# EAGLE design SparkFun_ProtoShield_Kit_rev40 (EAGLE 7.7.0)
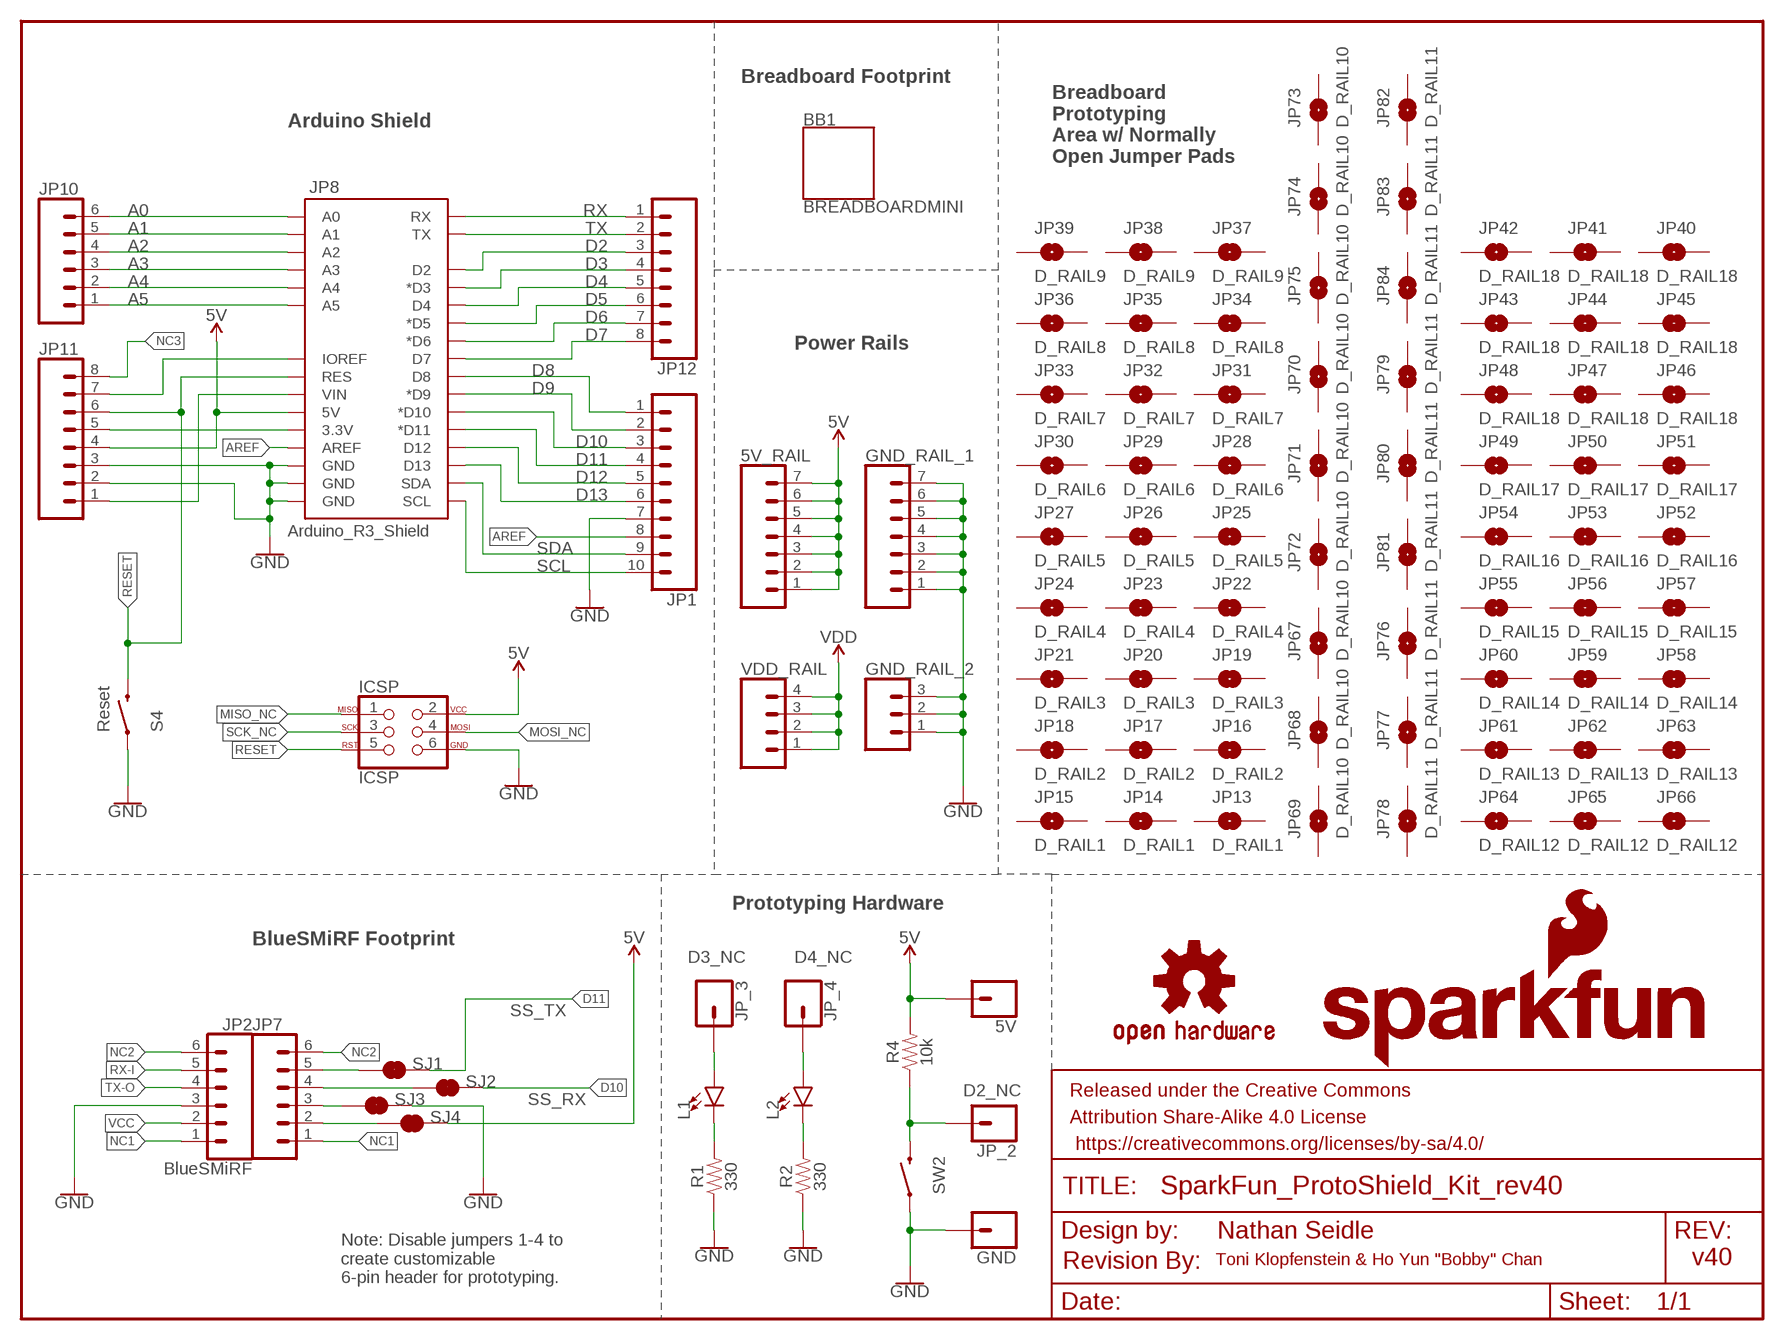
[diagram p0: schematic, sheet 1]

## Parts
5V  CONN_01  [1X01]
5V_RAIL  CONN_07NO_SILK  [1X07_NO_SILK]
BB1  BREADBOARDMINI  [BREADBOARD-MINI]
FRAME1  FRAME-LETTER  [CREATIVE_COMMONS]
GND  CONN_01  [1X01]
GND_RAIL_1  CONN_07NO_SILK  [1X07_NO_SILK]
GND_RAIL_2  CONN_031X03_NO_SILK  [1X03_NO_SILK]
ICSP  ICSP  AVR_SPI_PROG_3X2PTH  [2X3]
JP1  CONN_10"  [1X10]
JP2  BlueSMiRF  CONN_06SILK_FEMALE_PTH  [1X06]
JP7  CONN_06SILK_FEMALE_PTH  [1X06]
JP8  ARDUINO_R3_SHIELDR3_PROTO_SHIELD  [UNO_R3_PROTO_SHIELD]
JP10  CONN_06SILK_FEMALE_PTH  [1X06]
JP11  CONN_08"  [1X08]
JP12  CONN_08"  [1X08]
JP13  D_RAIL1  JUMPER-SMT_2_NO_NO-SILK  [SMT-JUMPER_2_NO_NO-SILK]
JP14  D_RAIL1  JUMPER-SMT_2_NO_NO-SILK  [SMT-JUMPER_2_NO_NO-SILK]
JP15  D_RAIL1  JUMPER-SMT_2_NO_NO-SILK  [SMT-JUMPER_2_NO_NO-SILK]
JP16  D_RAIL2  JUMPER-SMT_2_NO_NO-SILK  [SMT-JUMPER_2_NO_NO-SILK]
JP17  D_RAIL2  JUMPER-SMT_2_NO_NO-SILK  [SMT-JUMPER_2_NO_NO-SILK]
JP18  D_RAIL2  JUMPER-SMT_2_NO_NO-SILK  [SMT-JUMPER_2_NO_NO-SILK]
JP19  D_RAIL3  JUMPER-SMT_2_NO_NO-SILK  [SMT-JUMPER_2_NO_NO-SILK]
JP20  D_RAIL3  JUMPER-SMT_2_NO_NO-SILK  [SMT-JUMPER_2_NO_NO-SILK]
JP21  D_RAIL3  JUMPER-SMT_2_NO_NO-SILK  [SMT-JUMPER_2_NO_NO-SILK]
JP22  D_RAIL4  JUMPER-SMT_2_NO_NO-SILK  [SMT-JUMPER_2_NO_NO-SILK]
JP23  D_RAIL4  JUMPER-SMT_2_NO_NO-SILK  [SMT-JUMPER_2_NO_NO-SILK]
JP24  D_RAIL4  JUMPER-SMT_2_NO_NO-SILK  [SMT-JUMPER_2_NO_NO-SILK]
JP25  D_RAIL5  JUMPER-SMT_2_NO_NO-SILK  [SMT-JUMPER_2_NO_NO-SILK]
JP26  D_RAIL5  JUMPER-SMT_2_NO_NO-SILK  [SMT-JUMPER_2_NO_NO-SILK]
JP27  D_RAIL5  JUMPER-SMT_2_NO_NO-SILK  [SMT-JUMPER_2_NO_NO-SILK]
JP28  D_RAIL6  JUMPER-SMT_2_NO_NO-SILK  [SMT-JUMPER_2_NO_NO-SILK]
JP29  D_RAIL6  JUMPER-SMT_2_NO_NO-SILK  [SMT-JUMPER_2_NO_NO-SILK]
JP30  D_RAIL6  JUMPER-SMT_2_NO_NO-SILK  [SMT-JUMPER_2_NO_NO-SILK]
JP31  D_RAIL7  JUMPER-SMT_2_NO_NO-SILK  [SMT-JUMPER_2_NO_NO-SILK]
JP32  D_RAIL7  JUMPER-SMT_2_NO_NO-SILK  [SMT-JUMPER_2_NO_NO-SILK]
JP33  D_RAIL7  JUMPER-SMT_2_NO_NO-SILK  [SMT-JUMPER_2_NO_NO-SILK]
JP34  D_RAIL8  JUMPER-SMT_2_NO_NO-SILK  [SMT-JUMPER_2_NO_NO-SILK]
JP35  D_RAIL8  JUMPER-SMT_2_NO_NO-SILK  [SMT-JUMPER_2_NO_NO-SILK]
JP36  D_RAIL8  JUMPER-SMT_2_NO_NO-SILK  [SMT-JUMPER_2_NO_NO-SILK]
JP37  D_RAIL9  JUMPER-SMT_2_NO_NO-SILK  [SMT-JUMPER_2_NO_NO-SILK]
JP38  D_RAIL9  JUMPER-SMT_2_NO_NO-SILK  [SMT-JUMPER_2_NO_NO-SILK]
JP39  D_RAIL9  JUMPER-SMT_2_NO_NO-SILK  [SMT-JUMPER_2_NO_NO-SILK]
JP40  D_RAIL18  JUMPER-SMT_2_NO_NO-SILK  [SMT-JUMPER_2_NO_NO-SILK]
JP41  D_RAIL18  JUMPER-SMT_2_NO_NO-SILK  [SMT-JUMPER_2_NO_NO-SILK]
JP42  D_RAIL18  JUMPER-SMT_2_NO_NO-SILK  [SMT-JUMPER_2_NO_NO-SILK]
JP43  D_RAIL18  JUMPER-SMT_2_NO_NO-SILK  [SMT-JUMPER_2_NO_NO-SILK]
JP44  D_RAIL18  JUMPER-SMT_2_NO_NO-SILK  [SMT-JUMPER_2_NO_NO-SILK]
JP45  D_RAIL18  JUMPER-SMT_2_NO_NO-SILK  [SMT-JUMPER_2_NO_NO-SILK]
JP46  D_RAIL18  JUMPER-SMT_2_NO_NO-SILK  [SMT-JUMPER_2_NO_NO-SILK]
JP47  D_RAIL18  JUMPER-SMT_2_NO_NO-SILK  [SMT-JUMPER_2_NO_NO-SILK]
JP48  D_RAIL18  JUMPER-SMT_2_NO_NO-SILK  [SMT-JUMPER_2_NO_NO-SILK]
JP49  D_RAIL17  JUMPER-SMT_2_NO_NO-SILK  [SMT-JUMPER_2_NO_NO-SILK]
JP50  D_RAIL17  JUMPER-SMT_2_NO_NO-SILK  [SMT-JUMPER_2_NO_NO-SILK]
JP51  D_RAIL17  JUMPER-SMT_2_NO_NO-SILK  [SMT-JUMPER_2_NO_NO-SILK]
JP52  D_RAIL16  JUMPER-SMT_2_NO_NO-SILK  [SMT-JUMPER_2_NO_NO-SILK]
JP53  D_RAIL16  JUMPER-SMT_2_NO_NO-SILK  [SMT-JUMPER_2_NO_NO-SILK]
JP54  D_RAIL16  JUMPER-SMT_2_NO_NO-SILK  [SMT-JUMPER_2_NO_NO-SILK]
JP55  D_RAIL15  JUMPER-SMT_2_NO_NO-SILK  [SMT-JUMPER_2_NO_NO-SILK]
JP56  D_RAIL15  JUMPER-SMT_2_NO_NO-SILK  [SMT-JUMPER_2_NO_NO-SILK]
JP57  D_RAIL15  JUMPER-SMT_2_NO_NO-SILK  [SMT-JUMPER_2_NO_NO-SILK]
JP58  D_RAIL14  JUMPER-SMT_2_NO_NO-SILK  [SMT-JUMPER_2_NO_NO-SILK]
JP59  D_RAIL14  JUMPER-SMT_2_NO_NO-SILK  [SMT-JUMPER_2_NO_NO-SILK]
JP60  D_RAIL14  JUMPER-SMT_2_NO_NO-SILK  [SMT-JUMPER_2_NO_NO-SILK]
JP61  D_RAIL13  JUMPER-SMT_2_NO_NO-SILK  [SMT-JUMPER_2_NO_NO-SILK]
JP62  D_RAIL13  JUMPER-SMT_2_NO_NO-SILK  [SMT-JUMPER_2_NO_NO-SILK]
JP63  D_RAIL13  JUMPER-SMT_2_NO_NO-SILK  [SMT-JUMPER_2_NO_NO-SILK]
JP64  D_RAIL12  JUMPER-SMT_2_NO_NO-SILK  [SMT-JUMPER_2_NO_NO-SILK]
JP65  D_RAIL12  JUMPER-SMT_2_NO_NO-SILK  [SMT-JUMPER_2_NO_NO-SILK]
JP66  D_RAIL12  JUMPER-SMT_2_NO_NO-SILK  [SMT-JUMPER_2_NO_NO-SILK]
JP67  D_RAIL10  JUMPER-SMT_2_NO_NO-SILK  [SMT-JUMPER_2_NO_NO-SILK]
JP68  D_RAIL10  JUMPER-SMT_2_NO_NO-SILK  [SMT-JUMPER_2_NO_NO-SILK]
JP69  D_RAIL10  JUMPER-SMT_2_NO_NO-SILK  [SMT-JUMPER_2_NO_NO-SILK]
JP70  D_RAIL10  JUMPER-SMT_2_NO_NO-SILK  [SMT-JUMPER_2_NO_NO-SILK]
JP71  D_RAIL10  JUMPER-SMT_2_NO_NO-SILK  [SMT-JUMPER_2_NO_NO-SILK]
JP72  D_RAIL10  JUMPER-SMT_2_NO_NO-SILK  [SMT-JUMPER_2_NO_NO-SILK]
JP73  D_RAIL10  JUMPER-SMT_2_NO_NO-SILK  [SMT-JUMPER_2_NO_NO-SILK]
JP74  D_RAIL10  JUMPER-SMT_2_NO_NO-SILK  [SMT-JUMPER_2_NO_NO-SILK]
JP75  D_RAIL10  JUMPER-SMT_2_NO_NO-SILK  [SMT-JUMPER_2_NO_NO-SILK]
JP76  D_RAIL11  JUMPER-SMT_2_NO_NO-SILK  [SMT-JUMPER_2_NO_NO-SILK]
JP77  D_RAIL11  JUMPER-SMT_2_NO_NO-SILK  [SMT-JUMPER_2_NO_NO-SILK]
JP78  D_RAIL11  JUMPER-SMT_2_NO_NO-SILK  [SMT-JUMPER_2_NO_NO-SILK]
JP79  D_RAIL11  JUMPER-SMT_2_NO_NO-SILK  [SMT-JUMPER_2_NO_NO-SILK]
JP80  D_RAIL11  JUMPER-SMT_2_NO_NO-SILK  [SMT-JUMPER_2_NO_NO-SILK]
JP81  D_RAIL11  JUMPER-SMT_2_NO_NO-SILK  [SMT-JUMPER_2_NO_NO-SILK]
JP82  D_RAIL11  JUMPER-SMT_2_NO_NO-SILK  [SMT-JUMPER_2_NO_NO-SILK]
JP83  D_RAIL11  JUMPER-SMT_2_NO_NO-SILK  [SMT-JUMPER_2_NO_NO-SILK]
JP84  D_RAIL11  JUMPER-SMT_2_NO_NO-SILK  [SMT-JUMPER_2_NO_NO-SILK]
JP_2  CONN_01  [1X01]
JP_3  CONN_01  [1X01]
JP_4  CONN_01  [1X01]
L1  LED3MM  [LED_3MM]
L2  LED3MM  [LED_3MM]
LOGO1  OSHW-LOGOS  [OSHW-LOGO-S]
R1  330  330OHM-HORIZ-1/10W-5%  [AXIAL-0.3]
R2  330  330OHM-HORIZ-1/10W-5%  [AXIAL-0.3]
R4  10k  10KOHM-HORIZ-1/4W-5%  [AXIAL-0.3]
S4  MOMENTARY-SWITCH-SPST-PTH-6.0MM  [TACTILE_SWITCH_PTH_6.0MM]
SJ1  JUMPER-SMT_2_NC_TRACE_SILK  [SMT-JUMPER_2_NC_TRACE_SILK]
SJ2  JUMPER-SMT_2_NC_TRACE_SILK  [SMT-JUMPER_2_NC_TRACE_SILK]
SJ3  JUMPER-SMT_2_NC_TRACE_SILK  [SMT-JUMPER_2_NC_TRACE_SILK]
SJ4  JUMPER-SMT_2_NC_TRACE_SILK  [SMT-JUMPER_2_NC_TRACE_SILK]
SW2  MOMENTARY-SWITCH-SPST-PTH-6.0MM  [TACTILE_SWITCH_PTH_6.0MM]
U$1  SFE_LOGO_NAME_FLAME.1_INCH  [SFE_LOGO_NAME_FLAME_.1]
U$2  REVISION  [REVISION]
VDD_RAIL  CONN_041X04_NO_SILK  [1X04_NO_SILK]

## Nets
3.3: JP8.3.3V JP11.5
5V [power]: 5V.1 5V_RAIL.1 5V_RAIL.2 5V_RAIL.3 5V_RAIL.4 5V_RAIL.5 5V_RAIL.6 5V_RAIL.7 ICSP.2 JP8.5V JP11.4 R4.P$2 SJ4.2
A1: JP8.A1 JP10.5
A2: JP8.A2 JP10.4
A5: JP8.A5 JP10.1
AREF: JP1.8 JP8.AREF
D2: JP8.D2 JP12.3
D2_NC: JP_2.1 R4.P$1 SW2.3
D3: JP8.D3(*D3) JP12.4
D4: JP8.D4 JP12.5
D5: JP8.D5(*D5) JP12.6
D6: JP8.D6(*D6) JP12.7
D7: JP8.D7 JP12.8
D8: JP1.1 JP8.D8
D9: JP1.2 JP8.D9(*D9)
D10: JP1.3 JP8.D10(*D10) SJ2.2
D11: JP1.4 JP8.D11(*D11) SJ1.2
D12: JP1.5 JP8.D12
D13: JP1.6 JP8.D13
GND [power]: GND.1 GND_RAIL_1.1 GND_RAIL_1.2 GND_RAIL_1.3 GND_RAIL_1.4 GND_RAIL_1.5 GND_RAIL_1.6 GND_RAIL_1.7 GND_RAIL_2.1 GND_RAIL_2.2 GND_RAIL_2.3 ICSP.6 JP1.7 JP2.3 JP7.3 JP8.GND@0(GND) JP8.GND@1(GND) JP8.GND@2(GND) JP11.2 JP11.3 R1.P$1 R2.P$1 S4.1 SJ3.1 SJ3.2 SW2.1
JP3: JP_3.1 L1.A
JP4: JP_4.1 L2.A
MISO_NC: ICSP.1
MOSI_NC: ICSP.4
N$1: JP8.IOREF JP11.7
N$2: JP8.A0 JP10.6
N$3: JP8.A4 JP10.2
N$4: JP8.A3 JP10.3
N$6: L1.K(C) R1.P$2
N$7: L2.K(C) R2.P$2
NC1: JP2.1 JP7.1
NC2: JP2.6 JP7.6
NC3: JP11.8
RESET: ICSP.5 JP8.RES JP11.6 S4.3
RX: JP8.RX JP12.1
RX-I: JP2.5 JP7.5 SJ1.1
SCK_NC: ICSP.3
SCL: JP1.10 JP8.SCL
SDA: JP1.9 JP8.SDA
TX: JP8.TX JP12.2
TX-O: JP2.4 JP7.4 SJ2.1
VCC: JP2.2 JP7.2 SJ4.1
VDD: VDD_RAIL.1 VDD_RAIL.2 VDD_RAIL.3 VDD_RAIL.4
VIN: JP8.VIN JP11.1
Unconnected: JP13.1 JP13.2 JP14.1 JP14.2 JP15.1 JP15.2 JP16.1 JP16.2 JP17.1 JP17.2 JP18.1 JP18.2 JP19.1 JP19.2 JP20.1 JP20.2 JP21.1 JP21.2 JP22.1 JP22.2 JP23.1 JP23.2 JP24.1 JP24.2 JP25.1 JP25.2 JP26.1 JP26.2 JP27.1 JP27.2 JP28.1 JP28.2 JP29.1 JP29.2 JP30.1 JP30.2 JP31.1 JP31.2 JP32.1 JP32.2 JP33.1 JP33.2 JP34.1 JP34.2 JP35.1 JP35.2 JP36.1 JP36.2 JP37.1 JP37.2 JP38.1 JP38.2 JP39.1 JP39.2 JP40.1 JP40.2 JP41.1 JP41.2 JP42.1 JP42.2 JP43.1 JP43.2 JP44.1 JP44.2 JP45.1 JP45.2 JP46.1 JP46.2 JP47.1 JP47.2 JP48.1 JP48.2 JP49.1 JP49.2 JP50.1 JP50.2 JP51.1 JP51.2 JP52.1 JP52.2 JP53.1 JP53.2 JP54.1 JP54.2 JP55.1 JP55.2 JP56.1 JP56.2 JP57.1 JP57.2 JP58.1 JP58.2 JP59.1 JP59.2 JP60.1 JP60.2 JP61.1 JP61.2 JP62.1 JP62.2 JP63.1 JP63.2 JP64.1 JP64.2 JP65.1 JP65.2 JP66.1 JP66.2 JP67.1 JP67.2 JP68.1 JP68.2 JP69.1 JP69.2 JP70.1 JP70.2 JP71.1 JP71.2 JP72.1 JP72.2 JP73.1 JP73.2 JP74.1 JP74.2 JP75.1 JP75.2 JP76.1 JP76.2 JP77.1 JP77.2 JP78.1 JP78.2 JP79.1 JP79.2 JP80.1 JP80.2 JP81.1 JP81.2 JP82.1 JP82.2 JP83.1 JP83.2 JP84.1 JP84.2

## Notes on the sheet
- Breadboard Footprint
- Arduino Shield
- Breadboard
  Prototyping
  Area w/ Normally
  Open Jumper Pads
- A0
- A1
- A2
- A3
- A4
- A5
- Power Rails
- Arduino_R3_Shield
- Reset
- Prototyping Hardware
- BlueSMiRF Footprint
- D3_NC | D4_NC
- SS_TX
- SS_RX
- Nathan Seidle
- Toni Klopfenstein & Ho Yun "Bobby" Chan | v40
- Note: Disable jumpers 1-4 to 
  create customizable 
  6-pin header for prototyping.

## Library data of the parts
5V GND JP_2-JP_4 = SparkFun-Connectors:CONN_01: Single connection point. Often used as Generic Header-pin footprint for 0.1 inch spaced/style header connections On any of the 0.1 inch spaced packages, you can populate with these: Break Away Headers - Straight <https://www.sparkfun.com/products/116> (PRT-00116) Break Away Male Headers - Right Angle <https://www.sparkfun.com/products/553> (PRT-00553) Female Headers <https://www.sparkfun.com/products/115> (PRT-00115) Break Away Headers - Machine Pin <https://www.sparkfun.com/products/117> (PRT-00117) Break Away Female Headers - Swiss Machine Pin <https://www.sparkfun.com/products/743> (PRT-00743) This device is also useful as a general connection point to wire up your design to another part of your project. Our various solder wires solder well into these plated through hole pads. Hook-Up Wire - Assortment (Stranded, 22 AWG) <https://www.sparkfun.com/products/11375> (PRT-11375) Hook-Up Wire - Assortment (Solid Core, 22 AWG) <https://www.sparkfun.com/products/11367> (PRT-11367) View the entire wire category on our website here <https://www.sparkfun.com/categories/141> Special notes: SMTSO-256-ET is a "flush mount" nut for a 4-40 screw. We mostly use this on specialty testbeds; it is a nice way to connect hardware to your PCB at an adjustable hieght. Also note, the SNAP packages are for using a snappable style connector. We sell a baggie of snaps and they are also used on two LilyPad designs: Snap Assortment - 30 pack (male and female) <https://www.sparkfun.com/products/11347> (DEV-11347) LilyPad Arduino SimpleSnap <https://www.sparkfun.com/products/10941> (DEV-10941) LilyPad SimpleSnap Protoboard <https://www.sparkfun.com/products/10940> (DEV-10940)
5V_RAIL GND_RAIL_1 = SparkFun-Connectors:CONN_07: Multi connection point. Often used as Generic Header-pin footprint for 0.1 inch spaced/style header connections On any of the 0.1 inch spaced packages, you can populate with these: Break Away Headers - Straight <https://www.sparkfun.com/products/116> (PRT-00116) Break Away Male Headers - Right Angle <https://www.sparkfun.com/products/553> (PRT-00553) Female Headers <https://www.sparkfun.com/products/115> (PRT-00115) Break Away Headers - Machine Pin <https://www.sparkfun.com/products/117> (PRT-00117) Break Away Female Headers - Swiss Machine Pin <https://www.sparkfun.com/products/743> (PRT-00743) For SCREWTERMINALS and SPRING TERMINALS visit here: Screw Terimnals on SparkFun.com <https://www.sparkfun.com/search/results?term=Screw+Terminals> (5mm/3.5mm/2.54mm spacing) This device is also useful as a general connection point to wire up your design to another part of your project. Our various solder wires solder well into these plated through hole pads. Hook-Up Wire - Assortment (Stranded, 22 AWG) <https://www.sparkfun.com/products/11375> (PRT-11375) Hook-Up Wire - Assortment (Solid Core, 22 AWG) <https://www.sparkfun.com/products/11367> (PRT-11367) View the entire wire category on our website here <https://www.sparkfun.com/categories/141> Special notes: Molex polarized connector foot print use with SKU : PRT-08231 with associated crimp pins and housings. 1MM SMD Version SKU: PRT-10208 NOTES ON THE VARIANTS LOCK and LOCK_LONGPADS... This footprint was designed to help hold the alignment of a through-hole component (i.e. 6-pin header) while soldering it into place. You may notice that each hole has been shifted either up or down by 0.005 of an inch from it's more standard position (which is a perfectly straight line). This slight alteration caused the pins (the squares in the middle) to touch the edges of the holes. Because they are alternating, it causes a "brace" to hold the component in place. 0.005 has proven to be the perfect amount of "off-center" position when using our standard breakaway headers. Although looks a little odd when you look at the bare footprint, once you have a header in there, the alteration is very hard to notice. Also,if you push a header all the way into place, it is covered up entirely on the bottom side.
BB1 = SparkFun-Boards:BREADBOARD: SparkFun Breadboard Mini This is the mechnical outline for the very small self adhesive breadboard from SparkFun Electronics and our prototyping breadboard of the same size. Good for very small proto areas. SparkFun Products: White <https://www.sparkfun.com/products/7916> Green <https://www.sparkfun.com/products/12046> Black <https://www.sparkfun.com/products/12047> Red <https://www.sparkfun.com/products/12044> Blue <https://www.sparkfun.com/products/12045> SparkFun Solder-able Breadboard-Mini <https://www.sparkfun.com/products/12702>; PROD_ID: COMP-12034
FRAME1 = SparkFun-Aesthetics:FRAME-LETTER: Schematic Frame - Letter Standard 8.5x11 US Letter frame
GND_RAIL_2 = SparkFun-Connectors:CONN_03: Multi connection point. Often used as Generic Header-pin footprint for 0.1 inch spaced/style header connections On any of the 0.1 inch spaced packages, you can populate with these: Break Away Headers - Straight <https://www.sparkfun.com/products/116> (PRT-00116) Break Away Male Headers - Right Angle <https://www.sparkfun.com/products/553> (PRT-00553) Female Headers <https://www.sparkfun.com/products/115> (PRT-00115) Break Away Headers - Machine Pin <https://www.sparkfun.com/products/117> (PRT-00117) Break Away Female Headers - Swiss Machine Pin <https://www.sparkfun.com/products/743> (PRT-00743) Stackable Header - 3 Pin (Female, 0.1") <https://www.sparkfun.com/products/13875> (PRT-13875) For SCREWTERMINALS and SPRING TERMINALS visit here: Screw Terimnals on SparkFun.com <https://www.sparkfun.com/search/results?term=Screw+Terminals> (5mm/3.5mm/2.54mm spacing) This device is also useful as a general connection point to wire up your design to another part of your project. Our various solder wires solder well into these plated through hole pads. Hook-Up Wire - Assortment (Stranded, 22 AWG) <https://www.sparkfun.com/products/11375> (PRT-11375) Hook-Up Wire - Assortment (Solid Core, 22 AWG) <https://www.sparkfun.com/products/11367> (PRT-11367) View the entire wire category on our website here <https://www.sparkfun.com/categories/141> Special notes: Molex polarized connector foot print use with SKU : PRT-08232 with associated crimp pins and housings.
ICSP = SparkFun-Connectors:AVR_SPI_PROG_3X2: AVR ISP 6 Pin This is the reduced ISP connector for AVR programming. Common on Arduino. This footprint will take up less PCB space and can be used with a 10-pin to 6-pin adapter such as SKU: BOB-08508 **Special note about "TEST_POINT" package. The stop mask is on the top side, so if you want your programming test points to be on the bottom of your board, make sure to place this package on the bottom side of the board. This also ensure that the orientation to program from the bottom side will be correct. SparkFun Products: SparkFun ISP Pogo Adapter <https://www.sparkfun.com/products/11591> - NS Tiny AVR Programmer <https://www.sparkfun.com/products/11801> -PTH
JP1 = SparkFun-Connectors:CONN_10: Multi connection point. Often used as Generic Header-pin footprint for 0.1 inch spaced/style header connections On any of the 0.1 inch spaced packages, you can populate with these: Break Away Headers - Straight <https://www.sparkfun.com/products/116> (PRT-00116) Break Away Male Headers - Right Angle <https://www.sparkfun.com/products/553> (PRT-00553) Female Headers <https://www.sparkfun.com/products/115> (PRT-00115) Break Away Headers - Machine Pin <https://www.sparkfun.com/products/117> (PRT-00117) Break Away Female Headers - Swiss Machine Pin <https://www.sparkfun.com/products/743> (PRT-00743) Arduino Stackable Header - 10 Pin <https://www.sparkfun.com/products/11376> (PRT-11376) For SCREWTERMINALS and SPRING TERMINALS visit here: Screw Terimnals on SparkFun.com <https://www.sparkfun.com/search/results?term=Screw+Terminals> (5mm/3.5mm/2.54mm spacing) This device is also useful as a general connection point to wire up your design to another part of your project. Our various solder wires solder well into these plated through hole pads. Hook-Up Wire - Assortment (Stranded, 22 AWG) <https://www.sparkfun.com/products/11375> (PRT-11375) Hook-Up Wire - Assortment (Solid Core, 22 AWG) <https://www.sparkfun.com/products/11367> (PRT-11367) View the entire wire category on our website here <https://www.sparkfun.com/categories/141> Special notes: Molex polarized connector foot print use with SKU : PRT-08231 with associated crimp pins and housings. 1MM SMD Version SKU: PRT-10208 NOTES ON THE VARIANTS LOCK and LOCK_LONGPADS... This footprint was designed to help hold the alignment of a through-hole component (i.e. 6-pin header) while soldering it into place. You may notice that each hole has been shifted either up or down by 0.005 of an inch from it's more standard position (which is a perfectly straight line). This slight alteration caused the pins (the squares in the middle) to touch the edges of the holes. Because they are alternating, it causes a "brace" to hold the component in place. 0.005 has proven to be the perfect amount of "off-center" position when using our standard breakaway headers. Although looks a little odd when you look at the bare footprint, once you have a header in there, the alteration is very hard to notice. Also,if you push a header all the way into place, it is covered up entirely on the bottom side.; PROD_ID: CONN-11563
JP2 JP7 JP10 = SparkFun-Connectors:CONN_06: Multi connection point. Often used as Generic Header-pin footprint for 0.1 inch spaced/style header connections On any of the 0.1 inch spaced packages, you can populate with these: Break Away Headers - Straight <https://www.sparkfun.com/products/116> (PRT-00116) Break Away Male Headers - Right Angle <https://www.sparkfun.com/products/553> (PRT-00553) Female Headers <https://www.sparkfun.com/products/115> (PRT-00115) Break Away Headers - Machine Pin <https://www.sparkfun.com/products/117> (PRT-00117) Break Away Female Headers - Swiss Machine Pin <https://www.sparkfun.com/products/743> (PRT-00743) Arduino Stackable Header - 6 Pin <https://www.sparkfun.com/products/9280> (PRT-09280) For SCREWTERMINALS and SPRING TERMINALS visit here: Screw Terimnals on SparkFun.com <https://www.sparkfun.com/search/results?term=Screw+Terminals> (5mm/3.5mm/2.54mm spacing) This device is also useful as a general connection point to wire up your design to another part of your project. Our various solder wires solder well into these plated through hole pads. Hook-Up Wire - Assortment (Stranded, 22 AWG) <https://www.sparkfun.com/products/11375> (PRT-11375) Hook-Up Wire - Assortment (Solid Core, 22 AWG) <https://www.sparkfun.com/products/11367> (PRT-11367) View the entire wire category on our website here <https://www.sparkfun.com/categories/141>; PROD_ID: CONN-08437
JP8 = TempLibrary:ARDUINO_R3_SHIELD: Shield form compatible with the Arduino Uno R3.
JP11 JP12 = SparkFun-Connectors:CONN_08: Multi connection point. Often used as Generic Header-pin footprint for 0.1 inch spaced/style header connections On any of the 0.1 inch spaced packages, you can populate with these: Break Away Headers - Straight <https://www.sparkfun.com/products/116> (PRT-00116) Break Away Male Headers - Right Angle <https://www.sparkfun.com/products/553> (PRT-00553) Female Headers <https://www.sparkfun.com/products/115> (PRT-00115) Break Away Headers - Machine Pin <https://www.sparkfun.com/products/117> (PRT-00117) Break Away Female Headers - Swiss Machine Pin <https://www.sparkfun.com/products/743> (PRT-00743) Arduino Stackable Header - 8 Pin <https://www.sparkfun.com/products/9279> (PRT-09279) For SCREWTERMINALS and SPRING TERMINALS visit here: Screw Terimnals on SparkFun.com <https://www.sparkfun.com/search/results?term=Screw+Terminals> (5mm/3.5mm/2.54mm spacing) This device is also useful as a general connection point to wire up your design to another part of your project. Our various solder wires solder well into these plated through hole pads. Hook-Up Wire - Assortment (Stranded, 22 AWG) <https://www.sparkfun.com/products/11375> (PRT-11375) Hook-Up Wire - Assortment (Solid Core, 22 AWG) <https://www.sparkfun.com/products/11367> (PRT-11367) View the entire wire category on our website here <https://www.sparkfun.com/categories/141> Special notes: Molex polarized connector foot print use with SKU : PRT-08231 with associated crimp pins and housings. 1MM SMD Version SKU: PRT-10208 NOTES ON THE VARIANTS LOCK and LOCK_LONGPADS... This footprint was designed to help hold the alignment of a through-hole component (i.e. 6-pin header) while soldering it into place. You may notice that each hole has been shifted either up or down by 0.005 of an inch from it's more standard position (which is a perfectly straight line). This slight alteration caused the pins (the squares in the middle) to touch the edges of the holes. Because they are alternating, it causes a "brace" to hold the component in place. 0.005 has proven to be the perfect amount of "off-center" position when using our standard breakaway headers. Although looks a little odd when you look at the bare footprint, once you have a header in there, the alteration is very hard to notice. Also,if you push a header all the way into place, it is covered up entirely on the bottom side.; PROD_ID: CONN-08438
JP13-JP84 = SparkFun-Jumpers:JUMPER-SMT_2_NO: Normally open jumper This jumper has two pads in close proximity to each other. Apply solder to close the connection. Round pads are easier to solder for beginners, but are a lot larger. SparkFun Product that uses the round pads: SparkFun EL Sequencer <https://www.sparkfun.com/products/12781>
L1 L2 = SparkFun-LED:LED: LED (Generic) Standard schematic elements and footprints for 5mm, 3mm, 1206, and 0603 sized LEDs. Generic LEDs with no color specified.; PROD_ID: DIO-08794
LOGO1 = SparkFun-Aesthetics:OSHW-LOGO: Open-Source Hardware (OSHW) Logo This logo indicates the piece of hardware it is found on incorporates a OSHW license and/or adheres to the definition of open source hardware found here: http://freedomdefined.org/OSHW
R1 R2 = SparkFun-Resistors:330OHM: 330Ω resistor A resistor is a passive two-terminal electrical component that implements electrical resistance as a circuit element. Resistors act to reduce current flow, and, at the same time, act to lower voltage levels within circuits. - Wikipedia; PROD_ID: RES-8371
R4 = SparkFun-Resistors:10KOHM: 10kΩ resistor A resistor is a passive two-terminal electrical component that implements electrical resistance as a circuit element. Resistors act to reduce current flow, and, at the same time, act to lower voltage levels within circuits. - Wikipedia; PROD_ID: RES-09435
S4 SW2 = SparkFun-Switches:MOMENTARY-SWITCH-SPST: Momentary Switch (Pushbutton) - SPST Normally-open (NO) SPST momentary switches (buttons, pushbuttons). Variants PTH-12MM - 12mm square, through-hole Momentary Pushbutton Switch - 12mm Square <https://www.sparkfun.com/products/9190> (COM-09190) PTH-6.0MM, PTH-6.0MM-KIT - 6.0mm square, through-hole Mini Pushbutton Switch <https://www.sparkfun.com/products/97> (COM-00097) KIT package intended for soldering kit's - only one side of pads' copper is exposed. PTH-RIGHT-ANGLE-KIT - Right-angle, through-hole Right Angle Tactile Button <https://www.sparkfun.com/products/10791> - Used on SparkFun BigTime Watch Kit <https://www.sparkfun.com/products/11734> SMD-12MM - 12mm square, surface-mount Tactile Button - SMD (12mm) <https://www.sparkfun.com/products/12993> (COM-12993) Used on SparkFun PicoBoard <https://www.sparkfun.com/products/11888> SMD-4.5MM - 4.5mm Square Trackball Switch Used on SparkFun Blackberry Trackballer Breakout <https://www.sparkfun.com/products/13169> SMD-4.6MMX2.8MM - 4.60mm x 2.80mm, surface mount Used on SparkFun SAMD21 Mini Breakout <https://www.sparkfun.com/products/13664> SMD-5.2MM, SMD-5.2-REDUNDANT - 5.2mm square, surface-mount Mini Pushbutton Switch - SMD <https://www.sparkfun.com/products/8720> (COM-08720) Used on Arduino Pro Mini <https://www.sparkfun.com/products/11114> REDUNDANT package connects both switch circuits together SMD-6.0X3.5MM - 6.0 x 3.5mm, surface mount Momentary Reset Switch SMD <https://www.sparkfun.com/products/8229> (COM-08229) SMD-6.2MM-TALL - 6.2mm square, surface mount Tactile Button - SMD (6mm) <https://www.sparkfun.com/products/12992> Used on SparkFun Digital Sandbox <https://www.sparkfun.com/products/12651> SMD-RIGHT-ANGLE - Right-angle, surface mount Used on SparkFun Block for Intel® Edison - Arduino <https://www.sparkfun.com/products/13036>; PROD_ID: SWCH-08441; SF_SKU: COM-00097
SJ1-SJ4 = SparkFun-Jumpers:JUMPER-SMT_2_NC_TRACE: Normally closed trace jumper This jumper has a trace between two pads so it's normally closed (NC). Use a razor knife to open the connection. For best results follow the IPC guidelines for cutting traces: Cutout at least 0.063 mm (0.005 in). Remove all loose material to clean up the cut area. Seal the cut with an approved epoxy. Reapply solder to reclose the connection.
U$1 = SparkFun-Aesthetics:SFE_LOGO_NAME_FLAME: SparkFun Font Logo w/ Flame This is the SparkFun full logo. The logo on the schematic will always be the same size; the package variant is the height of the flame part of the logo. Default layer for the logo on the board is tSilk.
U$2 = SparkFun-Aesthetics:REVISION
VDD_RAIL = SparkFun-Connectors:CONN_04: Multi connection point. Often used as Generic Header-pin footprint for 0.1 inch spaced/style header connections On any of the 0.1 inch spaced packages, you can populate with these: Break Away Headers - Straight <https://www.sparkfun.com/products/116> (PRT-00116) Break Away Male Headers - Right Angle <https://www.sparkfun.com/products/553> (PRT-00553) Female Headers <https://www.sparkfun.com/products/115> (PRT-00115) Break Away Headers - Machine Pin <https://www.sparkfun.com/products/117> (PRT-00117) Break Away Female Headers - Swiss Machine Pin <https://www.sparkfun.com/products/743> (PRT-00743) For SCREWTERMINALS and SPRING TERMINALS visit here: Screw Terimnals on SparkFun.com <https://www.sparkfun.com/search/results?term=Screw+Terminals> (5mm/3.5mm/2.54mm spacing) This device is also useful as a general connection point to wire up your design to another part of your project. Our various solder wires solder well into these plated through hole pads. Hook-Up Wire - Assortment (Stranded, 22 AWG) <https://www.sparkfun.com/products/11375> (PRT-11375) Hook-Up Wire - Assortment (Solid Core, 22 AWG) <https://www.sparkfun.com/products/11367> (PRT-11367) View the entire wire category on our website here <https://www.sparkfun.com/categories/141> Special notes: Molex polarized connector foot print use with SKU : PRT-08231 with associated crimp pins and housings. 1MM SMD Version SKU: PRT-10208; PROD_ID: CONN-09696

## Net classes
1 power: width 0.254 mm

## Board
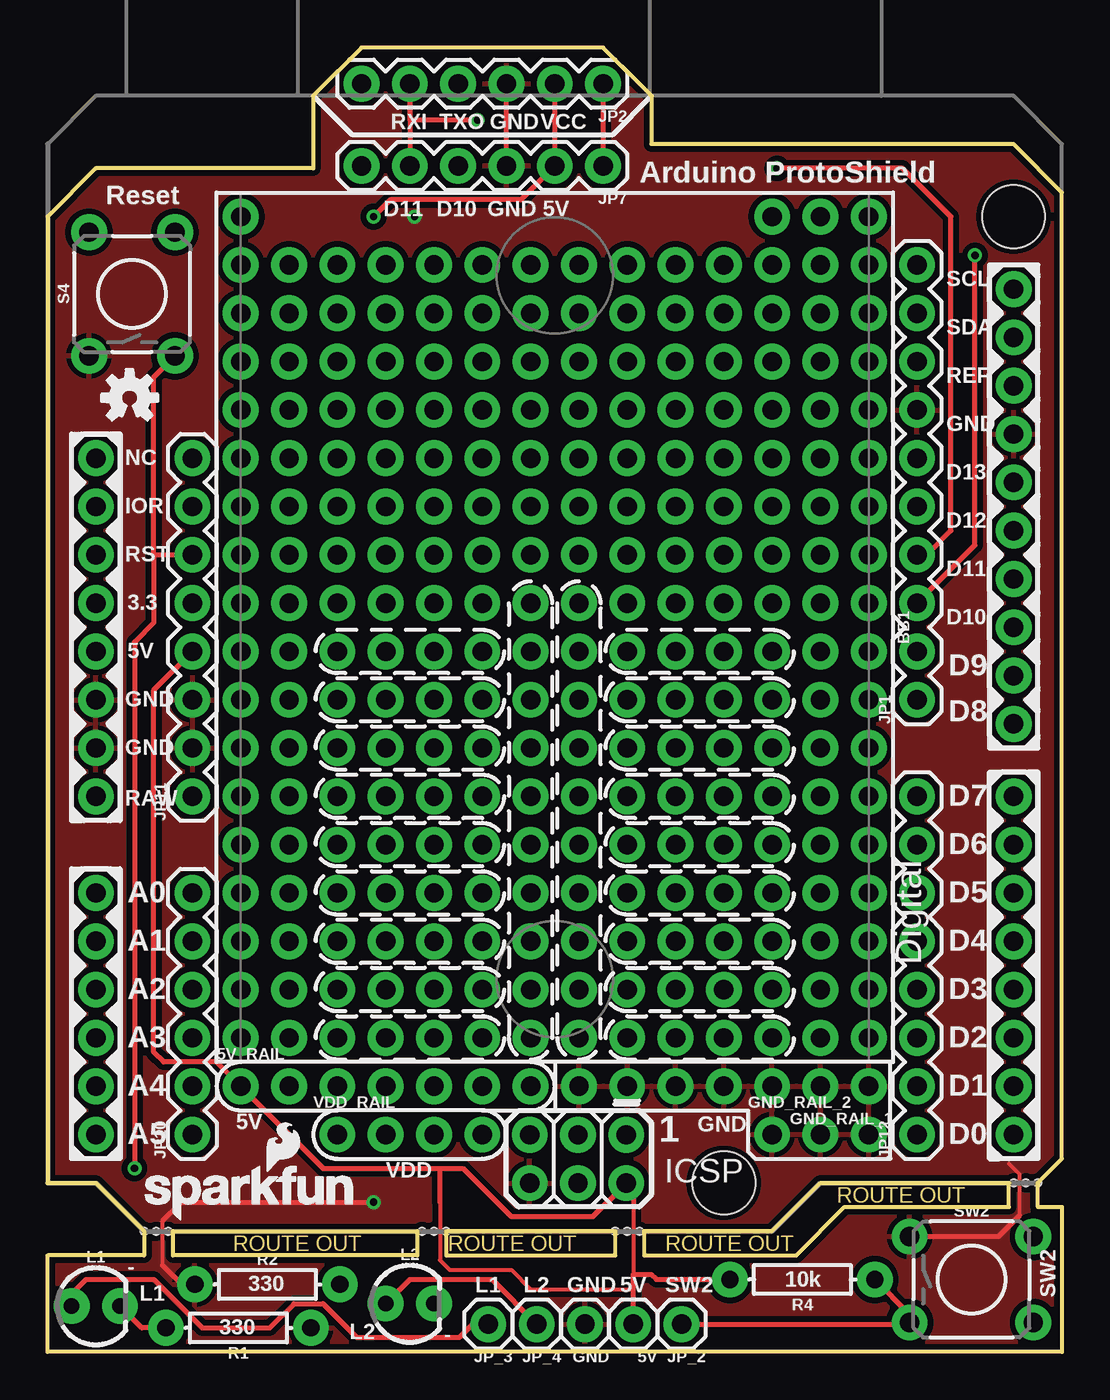
[diagram p1: board, top side]
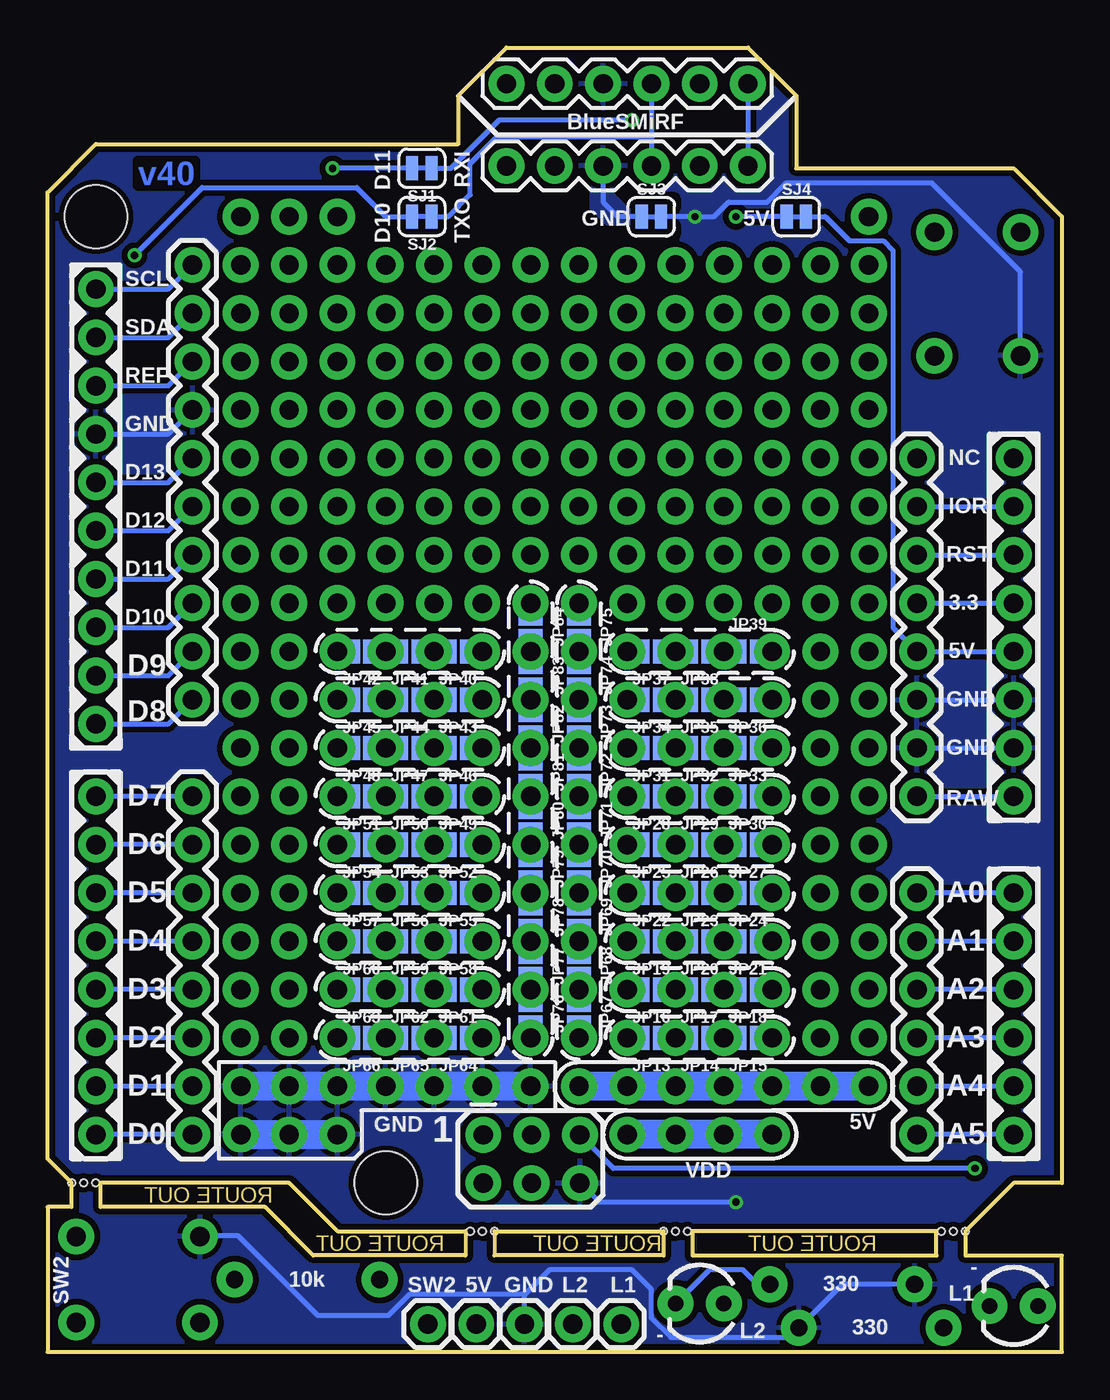
[diagram p2: board, bottom side, seen from below]

Size 53.34 x 68.58 mm. Coordinates in mm from the lower left corner, seen from the top.
Copper layers (1*16): Top 0.035mm / dielectric 1.5mm / Bottom 0.035mm
Design rules "SparkFun-2-layer-TIGHT": minimum track width 7mil, minimum drill 15mil, track to track 7mil, track to pad 7mil, pad to pad 7mil, via to via 7mil, smd to smd 7mil, copper to edge 7mil, drill to drill 7mil, minimum pad ring 7mil, minimum via ring 7mil, stop-mask expansion 4mil, vias tented up to drill 20mil, thermal gap 10mil
Holes 0.38 mm at 5.08,6.35 5.71,6.35 6.35,6.35 19.68,6.35 20.32,6.35 20.95,6.35 50.8,8.89 52.07,8.89 51.44,8.89 29.84,6.35 30.48,6.35 31.11,6.35
tRestrict: 5 lines
bRestrict: 12 lines

### Footprints (pad centres in the part's own frame; a part is rotated, then mirrored left to right if it is on the bottom)
1X01 = drill 1.016 pad 1.88: 1 0,0
1X07_NO_SILK = drill 1.016 pad 1.88: 1 0,0; 2 2.54,0; 3 5.08,0; 4 7.62,0; 5 10.16,0; 6 12.7,0; 7 15.24,0
1X03_NO_SILK = drill 1.016 pad 1.88: 1 0,0; 2 2.54,0; 3 5.08,0
2X3 = drill 1.016 pad 1.88: 1 0,0; 2 0,2.54; 3 2.54,0; 4 2.54,2.54; 5 5.08,0; 6 5.08,2.54
1X10 = drill 1.016 pad 1.88: 1 0,0; 2 2.54,0; 3 5.08,0; 4 7.62,0; 5 10.16,0; 6 12.7,0; 7 15.24,0; 8 17.78,0; 9 20.32,0; 10 22.86,0
1X06 = drill 1.016 pad 1.88: 1 0,0; 2 2.54,0; 3 5.08,0; 4 7.62,0; 5 10.16,0; 6 12.7,0
UNO_R3_PROTO_SHIELD = drill 1.016 pad 1.88: 3.3V 50.8,26.67; 5V 50.8,29.21; A0 50.8,41.91; A1 50.8,44.45; A2 50.8,46.99; A3 50.8,49.53; A4 50.8,52.07; A5 50.8,54.61; AREF 2.54,15.24; D2 2.54,49.53; D3 2.54,46.99; D4 2.54,44.45; D5 2.54,41.91; D6 2.54,39.37; D7 2.54,36.83; D8 2.54,33.02; D9 2.54,30.48; D10 2.54,27.94; D11 2.54,25.4; D12 2.54,22.86; D13 2.54,20.32; GND@0 50.8,31.75; GND@1 50.8,34.29; GND@2 2.54,17.78; IOREF 50.8,21.59; NC 50.8,19.05; RES 50.8,24.13; RX 2.54,54.61; SCL 2.54,10.16; SDA 2.54,12.7; TX 2.54,52.07; VIN 50.8,36.83 | hole 3.302: 2.54,6.35; 17.78,57.15
1X08 = drill 1.016 pad 1.88: 1 0,0; 2 2.54,0; 3 5.08,0; 4 7.62,0; 5 10.16,0; 6 12.7,0; 7 15.24,0; 8 17.78,0
SMT-JUMPER_2_NO_NO-SILK = smd 0.635 x 1.27: 1 -0.406,0; 2 0.406,0
LED_3MM = drill 0.813 pad 1.88: A -1.27,0; K 1.27,0
AXIAL-0.3 = drill 0.9 pad 1.88: P$1 -3.81,0; P$2 3.81,0
TACTILE_SWITCH_PTH_6.0MM = drill 1.016 pad 1.88: 1 -3.251,2.261; 2 3.251,2.261; 3 -3.251,-2.261; 4 3.251,-2.261
SMT-JUMPER_2_NC_TRACE_SILK = smd 0.635 x 1.27: 1 -0.508,0; 2 0.508,0
1X04_NO_SILK = drill 1.016 pad 1.88: 1 0,0; 2 2.54,0; 3 5.08,0; 4 7.62,0

### Placement (x,y rotation side)
5V  30.8,1.46 180 top
5V_RAIL  10.16,13.97 0 top
BB1  26.67,38.1 270 top
FRAME1  -0.74,-26.04 0 top  (outside the outline)
GND  28.26,1.46 180 top
GND_RAIL_1  43.18,13.97 180 top
GND_RAIL_2  38.1,11.43 0 top
ICSP  30.43,11.42 180 top
JP1  45.72,34.29 90 top
JP2  29.21,66.67 180 top
JP7  29.21,62.36 180 top
JP8  53.34,66.04 180 top
JP10  7.62,11.43 90 top
JP11  7.62,29.21 90 top
JP12  45.72,11.43 90 top
JP13  21.59,16.51 180 bottom
JP14  19.05,16.51 180 bottom
JP15  16.51,16.51 180 bottom
JP16  21.59,19.05 180 bottom
JP17  19.05,19.05 180 bottom
JP18  16.51,19.05 180 bottom
JP19  21.59,21.59 180 bottom
JP20  19.05,21.59 180 bottom
JP21  16.51,21.59 180 bottom
JP22  21.59,24.13 180 bottom
JP23  19.05,24.13 180 bottom
JP24  16.51,24.13 180 bottom
JP25  21.59,26.67 180 bottom
JP26  19.05,26.67 180 bottom
JP27  16.51,26.67 180 bottom
JP28  21.59,29.21 180 bottom
JP29  19.05,29.21 180 bottom
JP30  16.51,29.21 180 bottom
JP31  21.59,31.75 180 bottom
JP32  19.05,31.75 180 bottom
JP33  16.51,31.75 180 bottom
JP34  21.59,34.29 180 bottom
JP35  19.05,34.29 180 bottom
JP36  16.51,34.29 180 bottom
JP37  21.59,36.83 180 bottom
JP38  19.05,36.83 180 bottom
JP39  16.51,36.83 0 bottom
JP40  31.75,36.83 180 bottom
JP41  34.29,36.83 180 bottom
JP42  36.83,36.83 180 bottom
JP43  31.75,34.29 180 bottom
JP44  34.29,34.29 180 bottom
JP45  36.83,34.29 180 bottom
JP46  31.75,31.75 180 bottom
JP47  34.29,31.75 180 bottom
JP48  36.83,31.75 180 bottom
JP49  31.75,29.21 180 bottom
JP50  34.29,29.21 180 bottom
JP51  36.83,29.21 180 bottom
JP52  31.75,26.67 180 bottom
JP53  34.29,26.67 180 bottom
JP54  36.83,26.67 180 bottom
JP55  31.75,24.13 180 bottom
JP56  34.29,24.13 180 bottom
JP57  36.83,24.13 180 bottom
JP58  31.75,21.59 180 bottom
JP59  34.29,21.59 180 bottom
JP60  36.83,21.59 180 bottom
JP61  31.75,19.05 180 bottom
JP62  34.29,19.05 180 bottom
JP63  36.83,19.05 180 bottom
JP64  31.75,16.51 180 bottom
JP65  34.29,16.51 180 bottom
JP66  36.83,16.51 180 bottom
JP67  25.4,17.78 270 bottom
JP68  25.4,20.32 270 bottom
JP69  25.4,22.86 270 bottom
JP70  25.4,25.4 270 bottom
JP71  25.4,27.94 270 bottom
JP72  25.4,30.48 270 bottom
JP73  25.4,33.02 270 bottom
JP74  25.4,35.56 270 bottom
JP75  25.4,38.1 270 bottom
JP76  27.94,17.78 270 bottom
JP77  27.94,20.32 270 bottom
JP78  27.94,22.86 270 bottom
JP79  27.94,25.4 270 bottom
JP80  27.94,27.94 270 bottom
JP81  27.94,30.48 270 bottom
JP82  27.94,33.02 270 bottom
JP83  27.94,35.56 270 bottom
JP84  27.94,38.1 270 bottom
JP_2  33.34,1.46 180 top
JP_3  23.18,1.46 180 top
JP_4  25.72,1.46 180 top
L1  2.54,2.41 0 top
L2  19.05,2.54 0 top
LOGO1  4.32,50.16 0 top
R1  10.03,1.27 180 top
R2  11.56,3.56 0 top
R4  39.69,3.81 180 top
S4  4.45,55.63 90 top
SJ1  33.66,62.23 180 bottom
SJ2  33.66,59.69 180 bottom
SJ3  21.59,59.69 0 bottom
SJ4  13.97,59.69 0 bottom
SW2  48.58,3.81 0 top
U$1  4.7,6.86 0 top
U$2  10.79,-28.57 0 top  (outside the outline)
VDD_RAIL  15.24,11.43 0 top

### Tracks (layer width: path | path; a pad name or v marks a point on that pad's centre or on a via)
3.3
  Bottom 0.254: JP11.5 JP8.3.3V
5V
  Top 0.203: 30.8,7.62 30.8,4.06 | 20.64,7.87 20.64,4.83 21.14,4.32 24.38,4.32 25.4,3.3 30.73,3.3
  Top 0.254: 20.57,9.65 14.48,9.65 5V_RAIL.1 8.89,15.24 6.1,15.24 5.59,15.75 5.59,34.8 JP11.4 | 20.57,9.65 21.84,9.65 24.38,7.11 28.66,7.11 ICSP.2 30.8,8.51 30.8,7.62 | 20.64,7.87 20.64,9.59 20.57,9.65 | 5V.1 30.8,4.06 31.75,4.06 32,3.81 R4.P$2
  Bottom 0.254: JP8.5V JP11.4 8.89,38.1 8.89,57.91 9.4,58.42 11.18,58.42 12.45,59.69 SJ4.2
  Bottom 1.524: 5V_RAIL.1 5V_RAIL.2 5V_RAIL.3 5V_RAIL.4 5V_RAIL.5 5V_RAIL.6 5V_RAIL.7
A1
  Bottom 0.254: JP8.A1 JP10.5
A2
  Bottom 0.254: JP8.A2 JP10.4
A5
  Bottom 0.254: JP8.A5 JP10.1
AREF
  Bottom 0.254: JP8.AREF 46.99,50.8 JP1.8
D2
  Bottom 0.254: JP12.3 JP8.D2
D2_NC
  Top 0.254: R4.P$1 45.33,1.98 SW2.3 45.24,1.46 JP_2.1
D3
  Bottom 0.254: JP12.4 JP8.D3
D4
  Bottom 0.254: JP12.5 JP8.D4
D5
  Bottom 0.254: JP12.6 JP8.D5
D6
  Bottom 0.254: JP12.7 JP8.D6
D7
  Bottom 0.254: JP12.8 JP8.D7
D8
  Bottom 0.254: JP8.D8 46.99,33.02 JP1.1
D9
  Bottom 0.254: JP8.D9 46.99,35.56 JP1.2
D10  (via drill 0.38)
  Top 0.254: v48.77,57.66 48.77,42.42 JP1.3
  Bottom 0.254: JP8.D10 46.99,38.1 JP1.3 | SJ2.2 35.56,59.69 37.08,61.21 45.21,61.21 v48.77,57.66
D11  (via drill 0.38)
  Top 0.254: JP1.4 46.23,41.91 47.5,43.18 47.5,59.69 44.96,62.23 v38.35,62.23
  Bottom 0.254: SJ1.2 v38.35,62.23 | JP8.D11 46.99,40.64 JP1.4
D12
  Bottom 0.254: JP8.D12 46.99,43.18 JP1.5
D13
  Bottom 0.254: JP8.D13 46.99,45.72 JP1.6
GND  (via drill 0.38)
  Top 0.203: 51.12,7.18 51.12,9.34 50.55,9.91 | 6.03,6.86 6.03,4.57
  Top 0.254: SW2.1 50.01,6.07 51.12,7.18 | JP7.3 JP2.3 | 6.03,6.86 7.05,7.87 v17.14,7.87 | 6.03,4.57 7.05,3.56 R2.P$1
  Bottom 0.254: SJ3.2 v19.3,59.69 18.29,59.69 17.53,60.45 15.49,60.45 14.48,61.47 6.86,61.47 2.18,56.79 S4.1 | SJ3.1 23.37,59.69 24.13,60.45 JP7.3 | R2.P$1 11.56,3.56 R1.P$1 14.35,0.76 20.57,0.76 21.59,1.78 21.59,3.3 22.61,4.32 26.95,4.32 28.26,3.01 | SW2.1 45.3,6.1 43.31,6.1 39.12,1.91 35.43,1.91 34.31,3.02 28.27,3.02 28.26,3.01 | GND.1 28.26,3.01 | JP8.GND@2 46.99,48.26 JP1.7 | JP11.3 JP8.GND@0 | JP11.2 JP8.GND@1 | ICSP.6 24.38,7.91 24.38,7.87 v17.14,7.87
  Bottom 1.524: GND_RAIL_1.7 GND_RAIL_1.1 | GND_RAIL_2.3 GND_RAIL_2.1
  pour Top (isolate 0.305): 53.34,0 0,0 0,68.58 53.34,68.58
  pour Bottom (isolate 0.305): 53.34,0 0,0 0,68.58 53.34,68.58
JP3
  Top 0.254: L1.A 1.27,3.05 2.03,3.81 5.59,3.81 8.13,1.27 11.68,1.27 12.95,2.54 14.48,2.54 16.26,0.76 21.65,0.76 22.35,1.46 JP_3.1
JP4
  Top 0.254: JP_4.1 23.37,3.81 19.05,3.81 L2.A
N$1
  Bottom 0.254: JP11.7 JP8.IOREF
N$2
  Bottom 0.254: JP8.A0 JP10.6
N$3
  Bottom 0.254: JP8.A4 JP10.2
N$4
  Bottom 0.254: JP8.A3 JP10.3
N$5  (via drill 1.02 pad 1.88)
  other vias: 10.16,57.15
N$6
  Top 0.254: R1.P$2 4.95,1.27 L1.K
N$7
  Bottom 0.254: R2.P$2 16,3.56 16.76,4.32 18.54,4.32 L2.K
N$8  (via drill 1.02 pad 1.88)
  other vias: 10.16,16.51
N$9  (via drill 1.02 pad 1.88)
  other vias: 10.16,19.05
N$18  (via drill 1.02 pad 1.88)
  other vias: 38.1,16.51
N$19  (via drill 1.02 pad 1.88)
  other vias: 35.56,16.51
N$20  (via drill 1.02 pad 1.88)
  other vias: 12.7,16.51
N$21  (via drill 1.02 pad 1.88)
  other vias: 15.24,16.51
N$22  (via drill 1.02 pad 1.88)
  other vias: 17.78,16.51
N$23  (via drill 1.02 pad 1.88)
  other vias: 20.32,16.51
N$24  (via drill 1.02 pad 1.88)
  other vias: 22.86,16.51
N$25  (via drill 1.02 pad 1.88)
  other vias: 25.4,16.51
N$26  (via drill 1.02 pad 1.88)
  other vias: 27.94,16.51
N$27  (via drill 1.02 pad 1.88)
  other vias: 30.48,16.51
N$28  (via drill 1.02 pad 1.88)
  other vias: 33.02,16.51
N$29  (via drill 1.02 pad 1.88)
  other vias: 38.1,19.05
N$30  (via drill 1.02 pad 1.88)
  other vias: 35.56,19.05
N$31  (via drill 1.02 pad 1.88)
  other vias: 12.7,19.05
N$32  (via drill 1.02 pad 1.88)
  other vias: 15.24,19.05
N$33  (via drill 1.02 pad 1.88)
  other vias: 17.78,19.05
N$34  (via drill 1.02 pad 1.88)
  other vias: 20.32,19.05
N$35  (via drill 1.02 pad 1.88)
  other vias: 22.86,19.05
N$36  (via drill 1.02 pad 1.88)
  other vias: 25.4,19.05
N$37  (via drill 1.02 pad 1.88)
  other vias: 27.94,19.05
N$38  (via drill 1.02 pad 1.88)
  other vias: 30.48,19.05
N$39  (via drill 1.02 pad 1.88)
  other vias: 33.02,19.05
N$40  (via drill 1.02 pad 1.88)
  other vias: 38.1,21.59
N$41  (via drill 1.02 pad 1.88)
  other vias: 35.56,21.59
N$42  (via drill 1.02 pad 1.88)
  other vias: 12.7,21.59
N$43  (via drill 1.02 pad 1.88)
  other vias: 15.24,21.59
N$44  (via drill 1.02 pad 1.88)
  other vias: 17.78,21.59
N$45  (via drill 1.02 pad 1.88)
  other vias: 20.32,21.59
N$46  (via drill 1.02 pad 1.88)
  other vias: 22.86,21.59
N$47  (via drill 1.02 pad 1.88)
  other vias: 25.4,21.59
N$48  (via drill 1.02 pad 1.88)
  other vias: 27.94,21.59
N$49  (via drill 1.02 pad 1.88)
  other vias: 30.48,21.59
N$50  (via drill 1.02 pad 1.88)
  other vias: 33.02,21.59
N$51  (via drill 1.02 pad 1.88)
  other vias: 38.1,24.13
N$52  (via drill 1.02 pad 1.88)
  other vias: 35.56,24.13
N$53  (via drill 1.02 pad 1.88)
  other vias: 12.7,24.13
N$54  (via drill 1.02 pad 1.88)
  other vias: 15.24,24.13
N$55  (via drill 1.02 pad 1.88)
  other vias: 17.78,24.13
N$56  (via drill 1.02 pad 1.88)
  other vias: 20.32,24.13
N$57  (via drill 1.02 pad 1.88)
  other vias: 22.86,24.13
N$58  (via drill 1.02 pad 1.88)
  other vias: 25.4,24.13
N$59  (via drill 1.02 pad 1.88)
  other vias: 27.94,24.13
N$60  (via drill 1.02 pad 1.88)
  other vias: 30.48,24.13
N$61  (via drill 1.02 pad 1.88)
  other vias: 33.02,24.13
N$62  (via drill 1.02 pad 1.88)
  other vias: 38.1,26.67
N$63  (via drill 1.02 pad 1.88)
  other vias: 35.56,26.67
N$64  (via drill 1.02 pad 1.88)
  other vias: 12.7,26.67
N$65  (via drill 1.02 pad 1.88)
  other vias: 15.24,26.67
N$66  (via drill 1.02 pad 1.88)
  other vias: 17.78,26.67
N$67  (via drill 1.02 pad 1.88)
  other vias: 20.32,26.67
N$68  (via drill 1.02 pad 1.88)
  other vias: 22.86,26.67
N$69  (via drill 1.02 pad 1.88)
  other vias: 25.4,26.67
N$70  (via drill 1.02 pad 1.88)
  other vias: 27.94,26.67
N$71  (via drill 1.02 pad 1.88)
  other vias: 30.48,26.67
N$72  (via drill 1.02 pad 1.88)
  other vias: 33.02,26.67
N$73  (via drill 1.02 pad 1.88)
  other vias: 38.1,29.21
N$74  (via drill 1.02 pad 1.88)
  other vias: 35.56,29.21
N$75  (via drill 1.02 pad 1.88)
  other vias: 12.7,29.21
N$76  (via drill 1.02 pad 1.88)
  other vias: 15.24,29.21
N$77  (via drill 1.02 pad 1.88)
  other vias: 17.78,29.21
N$78  (via drill 1.02 pad 1.88)
  other vias: 20.32,29.21
N$79  (via drill 1.02 pad 1.88)
  other vias: 22.86,29.21
N$80  (via drill 1.02 pad 1.88)
  other vias: 25.4,29.21
N$81  (via drill 1.02 pad 1.88)
  other vias: 27.94,29.21
N$82  (via drill 1.02 pad 1.88)
  other vias: 30.48,29.21
N$83  (via drill 1.02 pad 1.88)
  other vias: 33.02,29.21
N$84  (via drill 1.02 pad 1.88)
  other vias: 38.1,31.75
N$85  (via drill 1.02 pad 1.88)
  other vias: 35.56,31.75
N$86  (via drill 1.02 pad 1.88)
  other vias: 12.7,31.75
N$87  (via drill 1.02 pad 1.88)
  other vias: 15.24,31.75
N$88  (via drill 1.02 pad 1.88)
  other vias: 17.78,31.75
N$89  (via drill 1.02 pad 1.88)
  other vias: 20.32,31.75
N$90  (via drill 1.02 pad 1.88)
  other vias: 22.86,31.75
N$91  (via drill 1.02 pad 1.88)
  other vias: 25.4,31.75
N$92  (via drill 1.02 pad 1.88)
  other vias: 27.94,31.75
N$93  (via drill 1.02 pad 1.88)
  other vias: 30.48,31.75
N$94  (via drill 1.02 pad 1.88)
  other vias: 33.02,31.75
N$95  (via drill 1.02 pad 1.88)
  other vias: 38.1,34.29
N$96  (via drill 1.02 pad 1.88)
  other vias: 35.56,34.29
N$97  (via drill 1.02 pad 1.88)
  other vias: 12.7,34.29
N$98  (via drill 1.02 pad 1.88)
  other vias: 15.24,34.29
N$99  (via drill 1.02 pad 1.88)
  other vias: 17.78,34.29
N$100  (via drill 1.02 pad 1.88)
  other vias: 20.32,34.29
N$101  (via drill 1.02 pad 1.88)
  other vias: 22.86,34.29
N$102  (via drill 1.02 pad 1.88)
  other vias: 25.4,34.29
N$103  (via drill 1.02 pad 1.88)
  other vias: 27.94,34.29
N$104  (via drill 1.02 pad 1.88)
  other vias: 30.48,34.29
N$105  (via drill 1.02 pad 1.88)
  other vias: 33.02,34.29
N$106  (via drill 1.02 pad 1.88)
  other vias: 38.1,36.83
N$107  (via drill 1.02 pad 1.88)
  other vias: 35.56,36.83
N$108  (via drill 1.02 pad 1.88)
  other vias: 12.7,36.83
N$109  (via drill 1.02 pad 1.88)
  other vias: 15.24,36.83
N$110  (via drill 1.02 pad 1.88)
  other vias: 17.78,36.83
N$111  (via drill 1.02 pad 1.88)
  other vias: 20.32,36.83
N$112  (via drill 1.02 pad 1.88)
  other vias: 22.86,36.83
N$113  (via drill 1.02 pad 1.88)
  other vias: 25.4,36.83
N$114  (via drill 1.02 pad 1.88)
  other vias: 27.94,36.83
N$115  (via drill 1.02 pad 1.88)
  other vias: 30.48,36.83
N$116  (via drill 1.02 pad 1.88)
  other vias: 33.02,36.83
N$117  (via drill 1.02 pad 1.88)
  other vias: 38.1,39.37
N$118  (via drill 1.02 pad 1.88)
  other vias: 35.56,39.37
N$119  (via drill 1.02 pad 1.88)
  other vias: 12.7,39.37
N$120  (via drill 1.02 pad 1.88)
  other vias: 15.24,39.37
N$121  (via drill 1.02 pad 1.88)
  other vias: 17.78,39.37
N$122  (via drill 1.02 pad 1.88)
  other vias: 20.32,39.37
N$123  (via drill 1.02 pad 1.88)
  other vias: 22.86,39.37
N$124  (via drill 1.02 pad 1.88)
  other vias: 25.4,39.37
N$125  (via drill 1.02 pad 1.88)
  other vias: 27.94,39.37
N$126  (via drill 1.02 pad 1.88)
  other vias: 30.48,39.37
N$127  (via drill 1.02 pad 1.88)
  other vias: 33.02,39.37
N$128  (via drill 1.02 pad 1.88)
  other vias: 38.1,41.91
N$129  (via drill 1.02 pad 1.88)
  other vias: 35.56,41.91
N$130  (via drill 1.02 pad 1.88)
  other vias: 12.7,41.91
N$131  (via drill 1.02 pad 1.88)
  other vias: 15.24,41.91
N$132  (via drill 1.02 pad 1.88)
  other vias: 17.78,41.91
N$133  (via drill 1.02 pad 1.88)
  other vias: 20.32,41.91
N$134  (via drill 1.02 pad 1.88)
  other vias: 22.86,41.91
N$135  (via drill 1.02 pad 1.88)
  other vias: 25.4,41.91
N$136  (via drill 1.02 pad 1.88)
  other vias: 27.94,41.91
N$137  (via drill 1.02 pad 1.88)
  other vias: 30.48,41.91
N$138  (via drill 1.02 pad 1.88)
  other vias: 33.02,41.91
N$139  (via drill 1.02 pad 1.88)
  other vias: 38.1,44.45
N$140  (via drill 1.02 pad 1.88)
  other vias: 35.56,44.45
N$141  (via drill 1.02 pad 1.88)
  other vias: 12.7,44.45
N$142  (via drill 1.02 pad 1.88)
  other vias: 15.24,44.45
N$143  (via drill 1.02 pad 1.88)
  other vias: 17.78,44.45
N$144  (via drill 1.02 pad 1.88)
  other vias: 20.32,44.45
N$145  (via drill 1.02 pad 1.88)
  other vias: 22.86,44.45
N$146  (via drill 1.02 pad 1.88)
  other vias: 25.4,44.45
N$147  (via drill 1.02 pad 1.88)
  other vias: 27.94,44.45
N$148  (via drill 1.02 pad 1.88)
  other vias: 30.48,44.45
N$149  (via drill 1.02 pad 1.88)
  other vias: 33.02,44.45
N$150  (via drill 1.02 pad 1.88)
  other vias: 38.1,46.99
N$151  (via drill 1.02 pad 1.88)
  other vias: 35.56,46.99
N$152  (via drill 1.02 pad 1.88)
  other vias: 12.7,46.99
N$153  (via drill 1.02 pad 1.88)
  other vias: 15.24,46.99
N$154  (via drill 1.02 pad 1.88)
  other vias: 17.78,46.99
N$155  (via drill 1.02 pad 1.88)
  other vias: 20.32,46.99
N$156  (via drill 1.02 pad 1.88)
  other vias: 22.86,46.99
N$157  (via drill 1.02 pad 1.88)
  other vias: 25.4,46.99
N$158  (via drill 1.02 pad 1.88)
  other vias: 27.94,46.99
N$159  (via drill 1.02 pad 1.88)
  other vias: 30.48,46.99
N$160  (via drill 1.02 pad 1.88)
  other vias: 33.02,46.99
N$161  (via drill 1.02 pad 1.88)
  other vias: 38.1,49.53
N$162  (via drill 1.02 pad 1.88)
  other vias: 35.56,49.53
N$163  (via drill 1.02 pad 1.88)
  other vias: 12.7,49.53
N$164  (via drill 1.02 pad 1.88)
  other vias: 15.24,49.53
N$165  (via drill 1.02 pad 1.88)
  other vias: 17.78,49.53
N$166  (via drill 1.02 pad 1.88)
  other vias: 20.32,49.53
N$167  (via drill 1.02 pad 1.88)
  other vias: 22.86,49.53
N$168  (via drill 1.02 pad 1.88)
  other vias: 25.4,49.53
N$169  (via drill 1.02 pad 1.88)
  other vias: 27.94,49.53
N$170  (via drill 1.02 pad 1.88)
  other vias: 30.48,49.53
N$171  (via drill 1.02 pad 1.88)
  other vias: 33.02,49.53
N$172  (via drill 1.02 pad 1.88)
  other vias: 38.1,52.07
N$173  (via drill 1.02 pad 1.88)
  other vias: 35.56,52.07
N$174  (via drill 1.02 pad 1.88)
  other vias: 12.7,52.07
N$175  (via drill 1.02 pad 1.88)
  other vias: 15.24,52.07
N$176  (via drill 1.02 pad 1.88)
  other vias: 17.78,52.07
N$177  (via drill 1.02 pad 1.88)
  other vias: 20.32,52.07
N$178  (via drill 1.02 pad 1.88)
  other vias: 22.86,52.07
N$179  (via drill 1.02 pad 1.88)
  other vias: 25.4,52.07
N$180  (via drill 1.02 pad 1.88)
  other vias: 27.94,52.07
N$181  (via drill 1.02 pad 1.88)
  other vias: 30.48,52.07
N$182  (via drill 1.02 pad 1.88)
  other vias: 33.02,52.07
N$183  (via drill 1.02 pad 1.88)
  other vias: 38.1,54.61
N$184  (via drill 1.02 pad 1.88)
  other vias: 10.16,21.59
N$185  (via drill 1.02 pad 1.88)
  other vias: 10.16,24.13
N$186  (via drill 1.02 pad 1.88)
  other vias: 10.16,26.67
N$187  (via drill 1.02 pad 1.88)
  other vias: 10.16,29.21
N$188  (via drill 1.02 pad 1.88)
  other vias: 35.56,54.61
N$189  (via drill 1.02 pad 1.88)
  other vias: 12.7,54.61
N$190  (via drill 1.02 pad 1.88)
  other vias: 15.24,54.61
N$191  (via drill 1.02 pad 1.88)
  other vias: 17.78,54.61
N$192  (via drill 1.02 pad 1.88)
  other vias: 20.32,54.61
N$193  (via drill 1.02 pad 1.88)
  other vias: 22.86,54.61
N$194  (via drill 1.02 pad 1.88)
  other vias: 25.4,54.61
N$195  (via drill 1.02 pad 1.88)
  other vias: 27.94,54.61
N$196  (via drill 1.02 pad 1.88)
  other vias: 30.48,54.61
N$197  (via drill 1.02 pad 1.88)
  other vias: 33.02,54.61
N$198  (via drill 1.02 pad 1.88)
  other vias: 38.1,57.15
N$199  (via drill 1.02 pad 1.88)
  other vias: 35.56,57.15
N$200  (via drill 1.02 pad 1.88)
  other vias: 12.7,57.15
N$201  (via drill 1.02 pad 1.88)
  other vias: 15.24,57.15
N$202  (via drill 1.02 pad 1.88)
  other vias: 17.78,57.15
N$203  (via drill 1.02 pad 1.88)
  other vias: 20.32,57.15
N$204  (via drill 1.02 pad 1.88)
  other vias: 22.86,57.15
N$205  (via drill 1.02 pad 1.88)
  other vias: 25.4,57.15
N$206  (via drill 1.02 pad 1.88)
  other vias: 27.94,57.15
N$207  (via drill 1.02 pad 1.88)
  other vias: 30.48,57.15
N$208  (via drill 1.02 pad 1.88)
  other vias: 33.02,57.15
N$209  (via drill 1.02 pad 1.88)
  other vias: 10.16,31.75
N$210  (via drill 1.02 pad 1.88)
  other vias: 10.16,34.29
N$211  (via drill 1.02 pad 1.88)
  other vias: 10.16,36.83
N$212  (via drill 1.02 pad 1.88)
  other vias: 10.16,39.37
N$213  (via drill 1.02 pad 1.88)
  other vias: 10.16,41.91
N$214  (via drill 1.02 pad 1.88)
  other vias: 10.16,44.45
N$215  (via drill 1.02 pad 1.88)
  other vias: 10.16,46.99
N$216  (via drill 1.02 pad 1.88)
  other vias: 10.16,49.53
N$217  (via drill 1.02 pad 1.88)
  other vias: 10.16,52.07
N$218  (via drill 1.02 pad 1.88)
  other vias: 10.16,54.61
N$219  (via drill 1.02 pad 1.88)
  other vias: 10.16,59.69
N$221  (via drill 1.02 pad 1.88)
  other vias: 40.64,16.51
N$222  (via drill 1.02 pad 1.88)
  other vias: 40.64,19.05
N$223  (via drill 1.02 pad 1.88)
  other vias: 40.64,21.59
N$224  (via drill 1.02 pad 1.88)
  other vias: 40.64,24.13
N$225  (via drill 1.02 pad 1.88)
  other vias: 40.64,26.67
N$226  (via drill 1.02 pad 1.88)
  other vias: 40.64,29.21
N$227  (via drill 1.02 pad 1.88)
  other vias: 40.64,31.75
N$228  (via drill 1.02 pad 1.88)
  other vias: 40.64,34.29
N$229  (via drill 1.02 pad 1.88)
  other vias: 40.64,36.83
N$230  (via drill 1.02 pad 1.88)
  other vias: 40.64,39.37
N$231  (via drill 1.02 pad 1.88)
  other vias: 40.64,41.91
N$232  (via drill 1.02 pad 1.88)
  other vias: 40.64,44.45
N$233  (via drill 1.02 pad 1.88)
  other vias: 40.64,46.99
N$234  (via drill 1.02 pad 1.88)
  other vias: 40.64,49.53
N$235  (via drill 1.02 pad 1.88)
  other vias: 40.64,52.07
N$236  (via drill 1.02 pad 1.88)
  other vias: 40.64,54.61
N$237  (via drill 1.02 pad 1.88)
  other vias: 40.64,57.15
N$239  (via drill 1.02 pad 1.88)
  other vias: 43.18,16.51
N$240  (via drill 1.02 pad 1.88)
  other vias: 43.18,19.05
N$241  (via drill 1.02 pad 1.88)
  other vias: 43.18,21.59
N$242  (via drill 1.02 pad 1.88)
  other vias: 43.18,24.13
N$243  (via drill 1.02 pad 1.88)
  other vias: 43.18,26.67
N$244  (via drill 1.02 pad 1.88)
  other vias: 43.18,29.21
N$245  (via drill 1.02 pad 1.88)
  other vias: 43.18,31.75
N$246  (via drill 1.02 pad 1.88)
  other vias: 43.18,34.29
N$247  (via drill 1.02 pad 1.88)
  other vias: 43.18,36.83
N$248  (via drill 1.02 pad 1.88)
  other vias: 43.18,39.37
N$249  (via drill 1.02 pad 1.88)
  other vias: 43.18,41.91
N$250  (via drill 1.02 pad 1.88)
  other vias: 43.18,44.45
N$251  (via drill 1.02 pad 1.88)
  other vias: 43.18,46.99
N$252  (via drill 1.02 pad 1.88)
  other vias: 43.18,49.53
N$253  (via drill 1.02 pad 1.88)
  other vias: 43.18,52.07
N$254  (via drill 1.02 pad 1.88)
  other vias: 43.18,54.61
N$255  (via drill 1.02 pad 1.88)
  other vias: 43.18,57.15
N$263  (via drill 1.02 pad 1.88)
  other vias: 38.1,59.69
N$264  (via drill 1.02 pad 1.88)
  other vias: 40.64,59.69
N$265  (via drill 1.02 pad 1.88)
  other vias: 43.18,59.69
NC1
  Top 0.254: JP2.1 JP7.1
NC2
  Bottom 0.254: JP2.6 JP7.6
RESET  (via drill 0.38)
  Top 0.254: 5.59,41.91 5.59,51.26 S4.3 | JP11.6 5.59,41.91 | 5.59,41.91 5.59,38.35 4.57,37.34 v4.57,9.65
  Bottom 0.254: JP11.6 JP8.RES | v4.57,9.65 23.59,9.65 ICSP.5
RX
  Bottom 0.254: JP12.1 JP8.RX | 45.09,11.43 JP12.1 | 46.35,11.43 JP12.1
RX-I  (via drill 0.38)
  Top 0.254: v22.61,64.77 19.05,64.77 JP2.5 JP7.5
  Bottom 0.254: v22.61,64.77 29.59,64.77 32.13,62.23 SJ1.1
SCL
  Bottom 0.254: JP8.SCL 46.99,55.88 JP1.10
SDA
  Bottom 0.254: JP8.SDA 46.99,53.34 JP1.9
TX
  Bottom 0.254: JP12.2 JP8.TX 48.9,13.97
TX-O
  Bottom 0.254: SJ2.1 32.26,59.69 31.11,60.83 31.11,62.48 29.72,63.88 21.59,63.88 | 21.59,63.88 JP7.4 | JP2.4 21.59,63.88
VCC  (via drill 0.38)
  Top 0.254: JP2.2 JP7.2 24.89,60.58 18.03,60.58 v17.14,59.69
  Bottom 0.254: SJ4.1 v17.14,59.69
VDD
  Bottom 1.524: VDD_RAIL.1 VDD_RAIL.2 VDD_RAIL.3 VDD_RAIL.4
VIN
  Bottom 0.254: JP11.1 JP8.VIN

### Text on the board
Bottom: v40
tPlace: RXI | TXO | GND | VCC | Arduino ProtoShield | Reset | D11 | D10 | GND | 5V | SCL | SDA | REF | GND | NC | D13 | IOR | D12 | RST | D11 | 3.3 | D10 | 5V | D9 | GND | D8 | GND | RAW | D7 | D6 | A0 | D5 | A1 | D4 | A2 | D3 | A3 | D2 | A4 | D1 | 5V | GND | A5 | 1 | D0 | VDD | - | L1 | 330 | L1 | L2 | GND | 5V | SW2 | 10k | SW2 | 330 | L2 | -
bPlace: BlueSMiRF | RXI | D11 | 5V | GND | TXO | D10 | SCL | SDA | REF | GND | NC | D13 | IOR | D12 | RST | D11 | 3.3 | D10 | 5V | D9 | GND | D8 | GND | RAW | D7 | D6 | A0 | D5 | A1 | D4 | A2 | D3 | A3 | D2 | A4 | D1 | 5V | GND | A5 | 1 | D0 | VDD | SW2 | - | L1 | 330 | L1 | L2 | GND | 5V | SW2 | 10k | 330 | L2 | -
tNames: Digital
Measures: Dimensions in Inches
tDocu: Nathan Seidle | Toni Klopfenstein & Ho Yun "Bobby" Chan